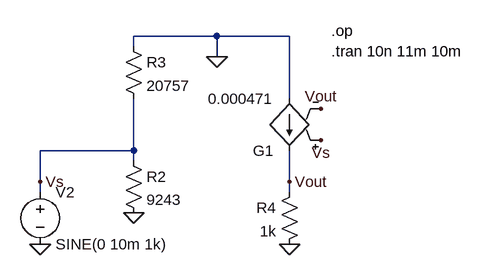
[diagram p0: schematic lab8-ac-ckt.asc]
lab8-ac-ckt.asc, the LTspice schematic file:
Version 4
SHEET 1 1228 680
WIRE -128 112 -256 112
WIRE -16 112 -128 112
WIRE -256 128 -256 112
WIRE -128 144 -128 112
WIRE -16 208 -16 112
WIRE -256 288 -256 208
WIRE -256 288 -400 288
WIRE -256 304 -256 288
WIRE -400 336 -400 288
WIRE -16 336 -16 288
WIRE -400 352 -400 336
WIRE -16 352 -16 336
FLAG -256 384 0
FLAG -400 432 0
FLAG -16 432 0
FLAG -400 336 Vs
FLAG -16 336 Vout
FLAG 32 272 Vs
FLAG -128 144 0
FLAG 32 224 Vout
SYMBOL Res -272 288 R0
SYMATTR InstName R2
SYMATTR Value 9243
SYMBOL Res -272 112 R0
SYMATTR InstName R3
SYMATTR Value 20757
SYMBOL voltage -400 336 R0
SYMATTR InstName V2
SYMATTR Value SINE(0 10m 1k)
SYMBOL Res 0 336 M0
SYMATTR InstName R4
SYMATTR Value 1k
SYMBOL g -16 304 R180
SYMATTR InstName G1
SYMATTR Value 0.000471
TEXT 48 104 Left 2 !.op\n.tran 10n 11m 10m

The netlist it stands for:
* lab8-ac-ckt.asc
R2 Vs 0 9243
R3 0 Vs 20757
V2 Vs 0 SINE(0 10m 1k)
R4 Vout 0 1k
G1 0 Vout Vs Vout 0.000471
.op
.tran 10n 11m 10m
.backanno
.end